# EAGLE schematic NanoPad (EAGLE 8.2.2)
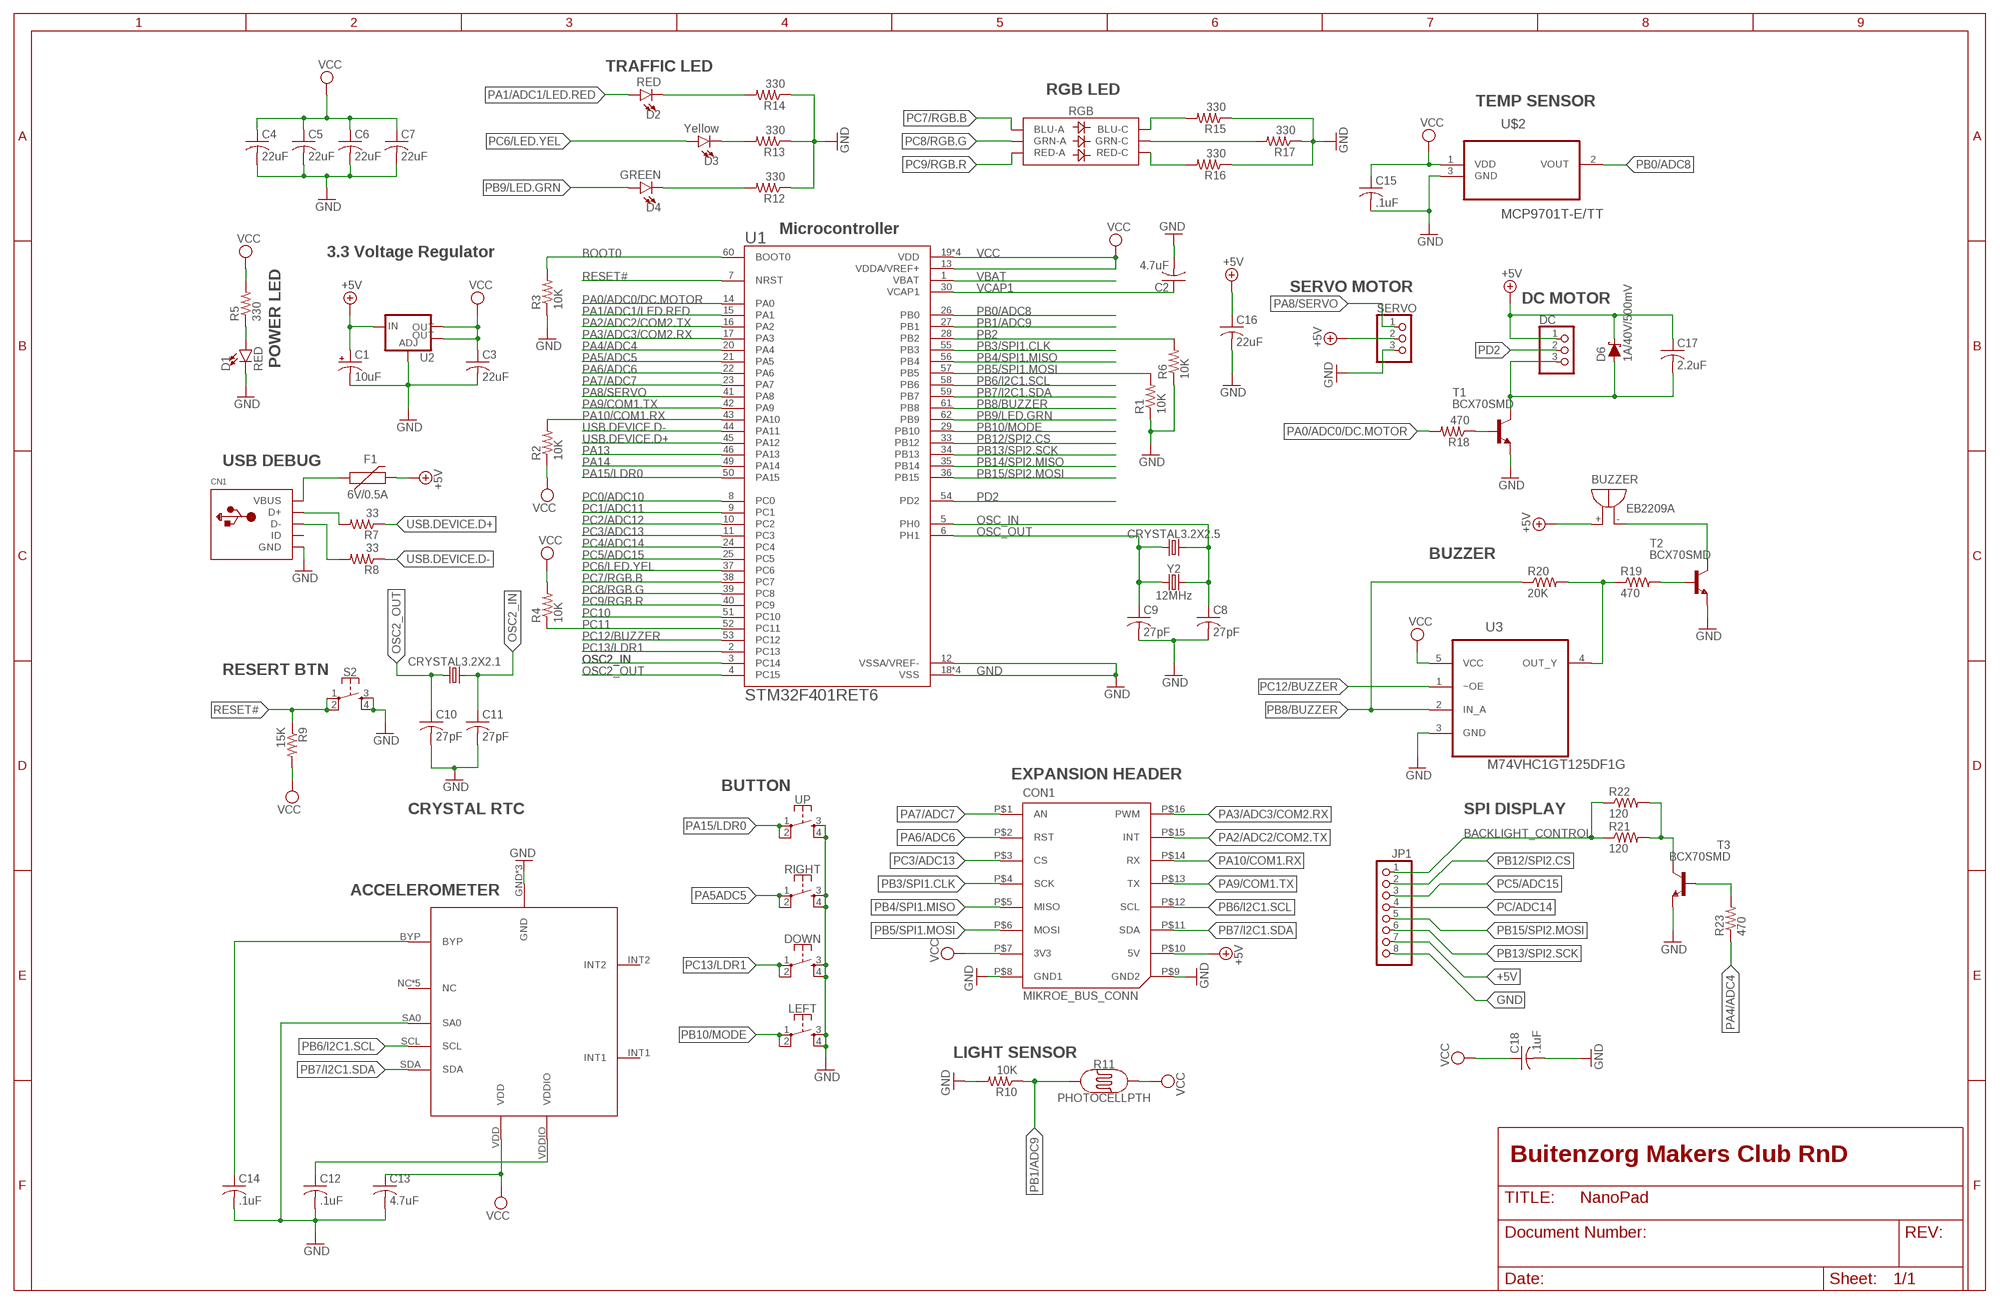
[diagram p0: schematic, sheet 1]

## Parts
BUZZER  EB2209A  [EB2209A]
C1  10uF  10UF-POLAR-0603-6.3V-20%(TANT)  [0603-POLAR]
C2  4.7uF  C-USC0603  [C0603]
C3  22uF  C-USC0603  [C0603]
C4  22uF  C-USC0603  [C0603]
C5  22uF  C-USC0603  [C0603]
C6  22uF  C-USC0603  [C0603]
C7  22uF  C-USC0603  [C0603]
C8  27pF  C-USC0603  [C0603]
C9  27pF  C-USC0603  [C0603]
C10  27pF  C-USC0603  [C0603]
C11  27pF  C-USC0603  [C0603]
C12  .1uF  C-USC0603  [C0603]
C13  4.7uF  C-USC0603  [C0603]
C14  .1uF  C-USC0603  [C0603]
C15  .1uF  C-USC0603  [C0603]
C16  22uF  C-USC0603  [C0603]
C17  2.2uF  C-USC0603  [C0603]
C18  .1uF  C-USC0603  [C0603]
CN1  USBMINIB  [USB-MINIB]
CON1  MIKROE_BUS_CONN  [MIKROBUS_HOST_CONN]
CRYSTAL3.2X2.1  CRYSTALSMD-3.2X2.5  [CRYSTAL-SMD-3.2X2.5MM]
CRYSTAL3.2X2.5  CRYSTALSMD-3.2X2.5  [CRYSTAL-SMD-3.2X2.5MM]
D1  RED  LED-RED0603  [LED-0603]
D2  RED  LED-RED0603  [LED-0603]
D3  Yellow  LED-YELLOW0603  [LED-0603]
D4  GREEN  LED-GREEN0603  [LED-0603]
D6  1A/40V/500mV  DIODE-SCHOTTKY-SS14  [SMA-DIODE]
DC  PINHD-1X3  [1X03]
DOWN  MOMENTARY-SWITCH-SPST-2-SMD-5.2MM  [TACTILE_SWITCH_SMD_5.2MM]
F1  6V/0.5A  PPTC_HALF-AMP  [1206]
JP1  PINHD-1X8CLEANBIG  [1X08-CLEANBIG]
LEFT  MOMENTARY-SWITCH-SPST-2-SMD-5.2MM  [TACTILE_SWITCH_SMD_5.2MM]
R1  10K  R-US_R0603  [R0603]
R2  10K  R-US_R0603  [R0603]
R3  10K  R-US_R0603  [R0603]
R4  10K  R-US_R0603  [R0603]
R5  330  R-US_R0603  [R0603]
R6  10K  R-US_R0603  [R0603]
R7  33  R-US_R0603  [R0603]
R8  33  R-US_R0603  [R0603]
R9  15K  R-US_R0603  [R0603]
R10  10K  R-US_R0603  [R0603]
R11  PHOTOCELLPTH  [PHOTOCELL]
R12  330  R-US_R0603  [R0603]
R13  330  R-US_R0603  [R0603]
R14  330  R-US_R0603  [R0603]
R15  330  R-US_R0603  [R0603]
R16  330  R-US_R0603  [R0603]
R17  330  R-US_R0603  [R0603]
R18  470  R-US_R0603  [R0603]
R19  470  R-US_R0603  [R0603]
R20  20K  R-US_R0603  [R0603]
R21  120  R-US_R0603  [R0603]
R22  120  R-US_R0603  [R0603]
R23  470  R-US_R0603  [R0603]
RGB  LED-RGBNO_IC  [LED-TRICOLOR-5050]
RIGHT  MOMENTARY-SWITCH-SPST-2-SMD-5.2MM  [TACTILE_SWITCH_SMD_5.2MM]
S2  MOMENTARY-SWITCH-SPST-2-SMD-5.2MM  [TACTILE_SWITCH_SMD_5.2MM]
SERVO  PINHD-1X3  [1X03]
T1  BCX70SMD  [SOT23]
T2  BCX70SMD  [SOT23]
T3  BCX70SMD  [SOT23]
U1  STM32F401RET6  [QFP50P1200X1200X160-64N]
U2  V_REG_LM1117SOT223  [SOT223]
U3  M74VHC1GT125DF1G  [SOT65P210X110-5N]
U$1  MMA8453QT  [MMA8453QT]
U$2  MCP9701T-E/TT  [SOT95P237X112-3N]
UP  MOMENTARY-SWITCH-SPST-2-SMD-5.2MM  [TACTILE_SWITCH_SMD_5.2MM]
Y2  12MHz  CRYSTAL-12MHZ"  [CRYSTAL-SMD-5X3.2-4PAD]

## Nets
+5V: BUZZER.+ C1.+ C16.1 C17.1 CON1.P$10(5V) D6.C DC.1 F1.2 JP1.7 SERVO.2 U2.3(IN)
BACKLIGHT_CONTROL: JP1.1 R21.1 R22.1
BOOT0: U1.60(BOOT0)
GND: C1.- C2.2 C3.2 C4.2 C5.2 C6.2 C7.2 C8.2 C9.2 C10.2 C11.2 C12.2 C13.2 C14.2 C15.2 C16.2 C18.2 CN1.GND CON1.P$8(GND1) CON1.P$9(GND2) D1.C DOWN.3 DOWN.4 JP1.8 LEFT.3 LEFT.4 R1.1 R6.1 R10.2 R12.1 R13.1 R14.1 R15.1 R16.1 R17.1 RIGHT.3 RIGHT.4 S2.3 S2.4 SERVO.3 T1.2(E) T2.2(E) T3.2(E) U1.12(VSSA/VREF-) U1.18(VSS) U1.31(VSS) U1.47(VSS) U1.63(VSS) U2.1(ADJ) U3.3(GND) U$1.GND U$1.GND2(GND) U$1.GND3(GND) U$1.SA0 U$2.3(GND) UP.3 UP.4
N$1: CN1.VBUS F1.1
N$2: CN1.D+ R7.2
N$3: D1.A R5.1
N$4: CN1.D- R8.2
N$5: C14.1 U$1.BYP
N$6: C12.1 U$1.VDDIO
N$7: D2.C R14.2
N$8: D3.C R13.2
N$9: D4.C R12.2
N$10: R17.2 RGB.6(GRN-C)
N$11: R15.2 RGB.4(BLU-C)
N$12: R16.2 RGB.5(RED-C)
N$13: R21.2 R22.2 T3.3(C)
N$14: C17.2 D6.A DC.3 T1.3(C)
N$15: R18.1 T1.1(B)
N$16: R23.2 T3.1(B)
N$17: R19.1 R20.2 U3.4(OUT_Y)
N$18: R19.2 T2.1(B)
N$19: BUZZER.- T2.3(C)
OSC2_IN: C11.1 CRYSTAL3.2X2.1.3 U1.3(PC14)
OSC2_OUT: C10.1 CRYSTAL3.2X2.1.1 U1.4(PC15)
OSC_IN: C8.1 CRYSTAL3.2X2.5.3 U1.5(PH0) Y2.3
OSC_OUT: C9.1 CRYSTAL3.2X2.5.1 U1.6(PH1) Y2.1
PA0/ADC0/DC.MOTOR: R18.2 U1.14(PA0)
PA1/ADC1/LED.RED: D2.A U1.15(PA1)
PA2/ADC2/COM2.TX: CON1.P$15(INT) U1.16(PA2)
PA3/ADC3/COM2.RX: CON1.P$16(PWM) U1.17(PA3)
PA4/ADC4: R23.1 U1.20(PA4)
PA5/ADC5: U1.21(PA5)
PA5ADC5: RIGHT.1 RIGHT.2
PA6/ADC6: CON1.P$2(RST) U1.22(PA6)
PA7/ADC7: CON1.P$1(AN) U1.23(PA7)
PA8/SERVO: SERVO.1 U1.41(PA8)
PA9/COM1.TX: CON1.P$13(TX) U1.42(PA9)
PA10/COM1.RX: CON1.P$14(RX) R2.2 U1.43(PA10)
PA13: U1.46(PA13)
PA14: U1.49(PA14)
PA15/LDR0: U1.50(PA15) UP.1 UP.2
PB0/ADC8: U1.26(PB0) U$2.2(VOUT)
PB1/ADC9: R10.1 R11.1 U1.27(PB1)
PB2: R6.2 U1.28(PB2)
PB3/SPI1.CLK: CON1.P$4(SCK) U1.55(PB3)
PB4/SPI1.MISO: CON1.P$5(MISO) U1.56(PB4)
PB5/SPI1.MOSI: CON1.P$6(MOSI) R1.2 U1.57(PB5)
PB6/I2C1.SCL: CON1.P$12(SCL) U1.58(PB6) U$1.SCL
PB7/I2C1.SDA: CON1.P$11(SDA) U1.59(PB7) U$1.SDA
PB8/BUZZER: R20.1 U1.61(PB8) U3.2(IN_A)
PB9/LED.GRN: D4.A U1.62(PB9)
PB10/MODE: LEFT.1 LEFT.2 U1.29(PB10)
PB12/SPI2.CS: JP1.2 U1.33(PB12)
PB13/SPI2.SCK: JP1.6 U1.34(PB13)
PB14/SPI2.MISO: U1.35(PB14)
PB15/SPI2.MOSI: JP1.5 U1.36(PB15)
PC0/ADC10: U1.8(PC0)
PC1/ADC11: U1.9(PC1)
PC2/ADC12: U1.10(PC2)
PC3/ADC13: CON1.P$3(CS) U1.11(PC3)
PC4/ADC14: U1.24(PC4)
PC5/ADC15: JP1.3 U1.25(PC5)
PC6/LED.YEL: D3.A U1.37(PC6)
PC7/RGB.B: RGB.3(BLU-A) U1.38(PC7)
PC8/RGB.G: RGB.1(GRN-A) U1.39(PC8)
PC9/RGB.R: RGB.2(RED-A) U1.40(PC9)
PC10: U1.51(PC10)
PC11: R4.1 U1.52(PC11)
PC12/BUZZER: U1.53(PC12) U3.1(~OE)
PC13/LDR1: DOWN.1 DOWN.2 U1.2(PC13)
PC/ADC14: JP1.4
PD2: DC.2 U1.54(PD2)
RESET#: R9.1 S2.1 S2.2 U1.7(NRST)
USB.DEVICE.D+: R7.1 U1.45(PA12)
USB.DEVICE.D-: R8.1 U1.44(PA11)
VBAT: U1.1(VBAT)
VCAP1: C2.1 U1.30(VCAP1)
VCC: C3.1 C4.1 C5.1 C6.1 C7.1 C13.1 C15.1 C18.1 CON1.P$7(3V3) R2.1 R4.2 R5.2 R9.2 R11.2 U1.13(VDDA/VREF+) U1.19(VDD) U1.32(VDD) U1.48(VDD) U1.64(VDD) U2.2(OUT) U2.4(OUT) U3.5(VCC) U$1.VDD U$2.1(VDD)
Unconnected: CN1.ID R3.1 R3.2 U$1.INT1 U$1.INT2 U$1.NC U$1.NC2(NC) U$1.NC3(NC) U$1.NC4(NC) U$1.NC5(NC)

## Notes on the sheet
- TRAFFIC LED
- RGB LED
- TEMP SENSOR
- Microcontroller
- 3.3 Voltage Regulator
- POWER LED
- SERVO MOTOR
- DC MOTOR
- USB DEBUG
- BUZZER
- RESERT BTN
- EXPANSION HEADER
- BUTTON
- CRYSTAL RTC | SPI DISPLAY
- ACCELEROMETER
- LIGHT SENSOR
- Buitenzorg Makers Club RnD

## Library data of the parts
BUZZER = buzzer:EB2209A: BUZZER Source: Buerklin; OC_FARNELL: unknown; OC_NEWARK: unknown
C1 = SparkFun-Capacitors:10UF-POLAR: 10.0µF polarized capacitors A capacitor is a passive two-terminal electrical component used to store electrical energy temporarily in an electric field.; PROD_ID: CAP-13210
C2-C18 = rcl:C-US: CAPACITOR, American symbol
CN1 = adafruit:USB: USB Connectors USBMINIB - Surface Mount Female Mini-B USB Connector 4UConnector: 06564 By microbuilder.eu Thru-hole RA Female Mini-B USB Connector 4UConnector: 18732 By ladyada.net
CON1 = mikrobus_lib:MIKROE_BUS_CONN
CRYSTAL3.2X2.1 CRYSTAL3.2X2.5 = SparkFun-Clocks:CRYSTAL: Crystals (Generic) These are passive quartz crystals, which can be used as a clock source for a microcontroller. Crystal's are two-terminal devices. They require external "load" capacitors to generate an oscillating signal.
D1 D2 = SparkFun-LED:LED-RED: Red SMD LED Used in manufacturing of most products at SparkFun Packages: 0603 - SMD 0603 package [Product Link] <http://docs.avagotech.com/docs/AV02-0551EN> 0603 SMART - SMD 0603 SMART package ( more efficient and expensive)[Product Link] <http://www.osram-os.com/Graphics/XPic2/00077099_0.pdf> 1206 - SMD1206 package [Product Link] <https://www.sparkfun.com/datasheets/DevTools/LilyPad/Q150OVS4.pdff> SparkFun Products: Pro Mini 328 -5V <https://www.sparkfun.com/products/821> RedBoard <https://www.sparkfun.com/products/12757> IOIO-OTG <https://www.sparkfun.com/products/13613>; PROD_ID: DIO-00819
D3 = SparkFun-LED:LED-YELLOW: Yellow SMD LED Used in manufacturing several products at SparkFun. Packages: 0603 - SMD 0603 package[Product Link] <http://www.kingbrightusa.com/product.asp?catalog_name=LED&product_id=APT1608SYCK> 0603 -SMART - SMART SMD 0603 package (more efficient/more expensive) [Product Link] <http://www.osram-os.com/osram_os/en/products/product-catalog/led-light-emitting-diodes/smartled-0603/ly-l29k/index.jsp> LilyPad - SMD1206 package[Product Datasheet] <https://www.sparkfun.com/datasheets/DevTools/LilyPad/Q150YUS4.pdf> SparkFun Products: Blynk Board <https://www.sparkfun.com/products/13794> IOIO-OTG <https://www.sparkfun.com/products/13613> XBee Explorer Serial <https://www.sparkfun.com/products/13225>; PROD_ID: DIO-09003
D4 = SparkFun-LED:LED-GREEN: Green SMD LED Used in manufacturing of various products at SparkFun Packages: 0603 - SMD 0603 package [Product Link] <http://www.futureelectronics.com/en/technologies/semiconductors/optoelectronics/leds/Pages/9894312-LTST-C190GKT.aspx?CrossPart=HSMG-C190&IM=0> LilyPad 1206 - SMD1206 LilyPad package [Product Link] <http://www.futureelectronics.com/en/Technologies/Product.aspx?ProductID=IN150NGHARVATEKCORPORATION2049943&IM=0> 1206 - SMD1206 package [Product Link] <http://www.futureelectronics.com/en/technologies/semiconductors/optoelectronics/leds/Pages/8315665-LTST-C150KGKT.aspx?IM=0> 1206 Bottom Mount -SMD 1206 Bottom Mount [Product Link] <http://www.digikey.com/product-detail/en/lite-on-inc/LTST-C230KGKT/160-1456-1-ND/386854> SparkFun Products: Pro Mini 328 -5V <https://www.sparkfun.com/products/821> RedBoard <https://www.sparkfun.com/products/12757> MP3 Trigger <https://www.sparkfun.com/products/13720> Makey Makey <https://www.sparkfun.com/products/11076>; PROD_ID: DIO-00821
D6 = SparkFun-DiscreteSemi:DIODE-SCHOTTKY: Schottky diode A Schottky diode is a semiconductor diode which has a low forward voltage drop and a very fast switching action.; PROD_ID: DIO-08053
DC SERVO = adafruit:PINHD-1X3: PIN HEADER
DOWN LEFT RIGHT S2 UP = SparkFun-Switches:MOMENTARY-SWITCH-SPST-2: Momentary Switch (Pushbutton) - SPST - Two Circuits Normally-open (NO) SPST momentary switches (buttons, pushbuttons). Schematic symbol includes two switch circuits. Variants SMD-4.6MMX2.8MM - 4.60mm x 2.80mm Tactile Momentary Button Switch - Used on SparkFun SAMD21 Mini Breakout <https://www.sparkfun.com/products/13664> SMD-5.2MM - Mini Pushbutton Switch - SMD <https://www.sparkfun.com/products/8720> - Used on Arduino Pro Mini <https://www.sparkfun.com/products/11114>; PROD_ID: SWCH-08247; SF_SKU: COM-08720
F1 = SparkFun-Fuses:PPTC: Resettable Fuse PPTC Resettable Fuse. Really a sort of resistor with a polymeric positive temperature coefficient whose resistance increases dramatically with an increase in temperature. When heated by the power passing through the resistance rises causing the current to be limited, protecting the circuit. This is achieved by the transition of the polymer from a crystalline to an amorphous state where the conductive carbon separates breaking the conductive pathways found in the cool crystalline structure. When a PPTC cools back down it resumes conducting letting the circuit turn back on. SparkFun Products: SparkFun RedBoard - Programmed with Arduino <https://www.sparkfun.com/products/12757> Pro Micro - 5V/16MHz <https://www.sparkfun.com/products/12640> Arduino Pro 328 - 5V/16MHz <https://www.sparkfun.com/products/10915> MP3 Trigger <https://www.sparkfun.com/products/13720>; PROD_ID: RES-08585
JP1 = adafruit:PINHD-1X8: PIN HEADER
R1-R10 R12-R23 = rcl:R-US_: RESISTOR, American symbol
R11 = SparkFun-Sensors:PHOTOCELL: Photocell (Photodetector, Photo Resistor, CdS) This is a very small light sensor. A photocell changes (also called a photodetector, photo resistor, CdS or photoconductive cell) resistance depending on the amount of light it is exposed to. These little sensors make great ambient light triggers (when light in the room turns on, do something). Datasheet <http://cdn.sparkfun.com/datasheets/Sensors/LightImaging/SEN-09088.pdf> SparkFun Products Mini Photocell <https://www.sparkfun.com/products/9088> (SEN-09088); PROD_ID: COMP-09129; SF_ID: SEN-09088
RGB = SparkFun-LED:LED-RGB: LED-RGB 6 pin RGB LED (no common connector) Packages: PLCC-6 LED-TRICOLOR-5050 - No built-in IC SparkFun Products: Digital Sandbox <https://www.sparkfun.com/products/12651> LED- SMD RGB <https://www.sparkfun.com/products/10866>; PROD_ID: DIO-10298
T1-T3 = transistor:BCX70SMD: NPN TRANSISTOR
U1 = STM32F401RET6:STM32F401RET6: MCU 32-Bit STM32 ARM Cortex M4 RISC 512KB Flash 1.8V/2.5V/3.3V 64-Pin LQFP Tray; AVAILABILITY: Good; DESCRIPTION: MCU 32-Bit STM32 ARM Cortex M4 RISC 512KB Flash 1.8V/2.5V/3.3V 64-Pin LQFP Tray; MF: STMicroelectronics; MP: STM32F401RET6; PACKAGE: LQFP-64 STMicroelectronics; PRICE: 5.66 USD
U2 = SparkFun-IC-Power:V_REG_LM1117: Voltage Regulator LM1117 Standard adjustable voltage regulator but in SMD form. Spark Fun Electronics SKU : COM-00595; PROD_ID: VREG-08170
U3 = M74VHC1GT125DF1G:M74VHC1GT125DF1G: Noninverting Buffer / CMOS Logic Level Shifter; AVAILABILITY: Good; DESCRIPTION: 74VHC Series SMT Single Non-Inverting Buffer / CMOS Logic Level Shifter SC-70-5; MF: ON Semiconductor; MP: M74VHC1GT125DF1G; PACKAGE: None; PRICE: 0.10 USD
U$1 = MMA8453QT:MMA8453QT; AVAILABILITY: Good; DESCRIPTION: Accelerometer Triple %C2%B12/%C2%B14/%C2%B18g 2.7V to 3.3V 16-Pin QFN EP Tray; MF: Freescale Semiconductor; MP: MMA8453QT; PACKAGE: QFN-16 Freescale Semiconductor; PRICE: 1.16 USD
U$2 = MCP9701T-E_TT:MCP9701T-E/TT: Low-Power Linear Active Thermistor; AVAILABILITY: Good; DESCRIPTION: Microchip MCP9701T-E/TT Temperature Sensor 3-Pin SOT-23%2C -40 - %2B125 degC; MF: Microchip; MP: MCP9701T-E/TT; PACKAGE: SOT-23-3 Microchip; PRICE: 0.22 USD
Y2 = SparkFun-Clocks:CRYSTAL-12MHZ: 12.0MHz Crystal Frequency: 12.0MHz Frequency Tolerance: ±20ppm Load Capacitance: 18pF SparkFun Products: SparkFun Logomatic <https://www.sparkfun.com/products/12772> Pocket AVR Programmer <https://www.sparkfun.com/products/9825>; PROD_ID: XTAL-08297